# EAGLE design 3bp (EAGLE 9.6.2)
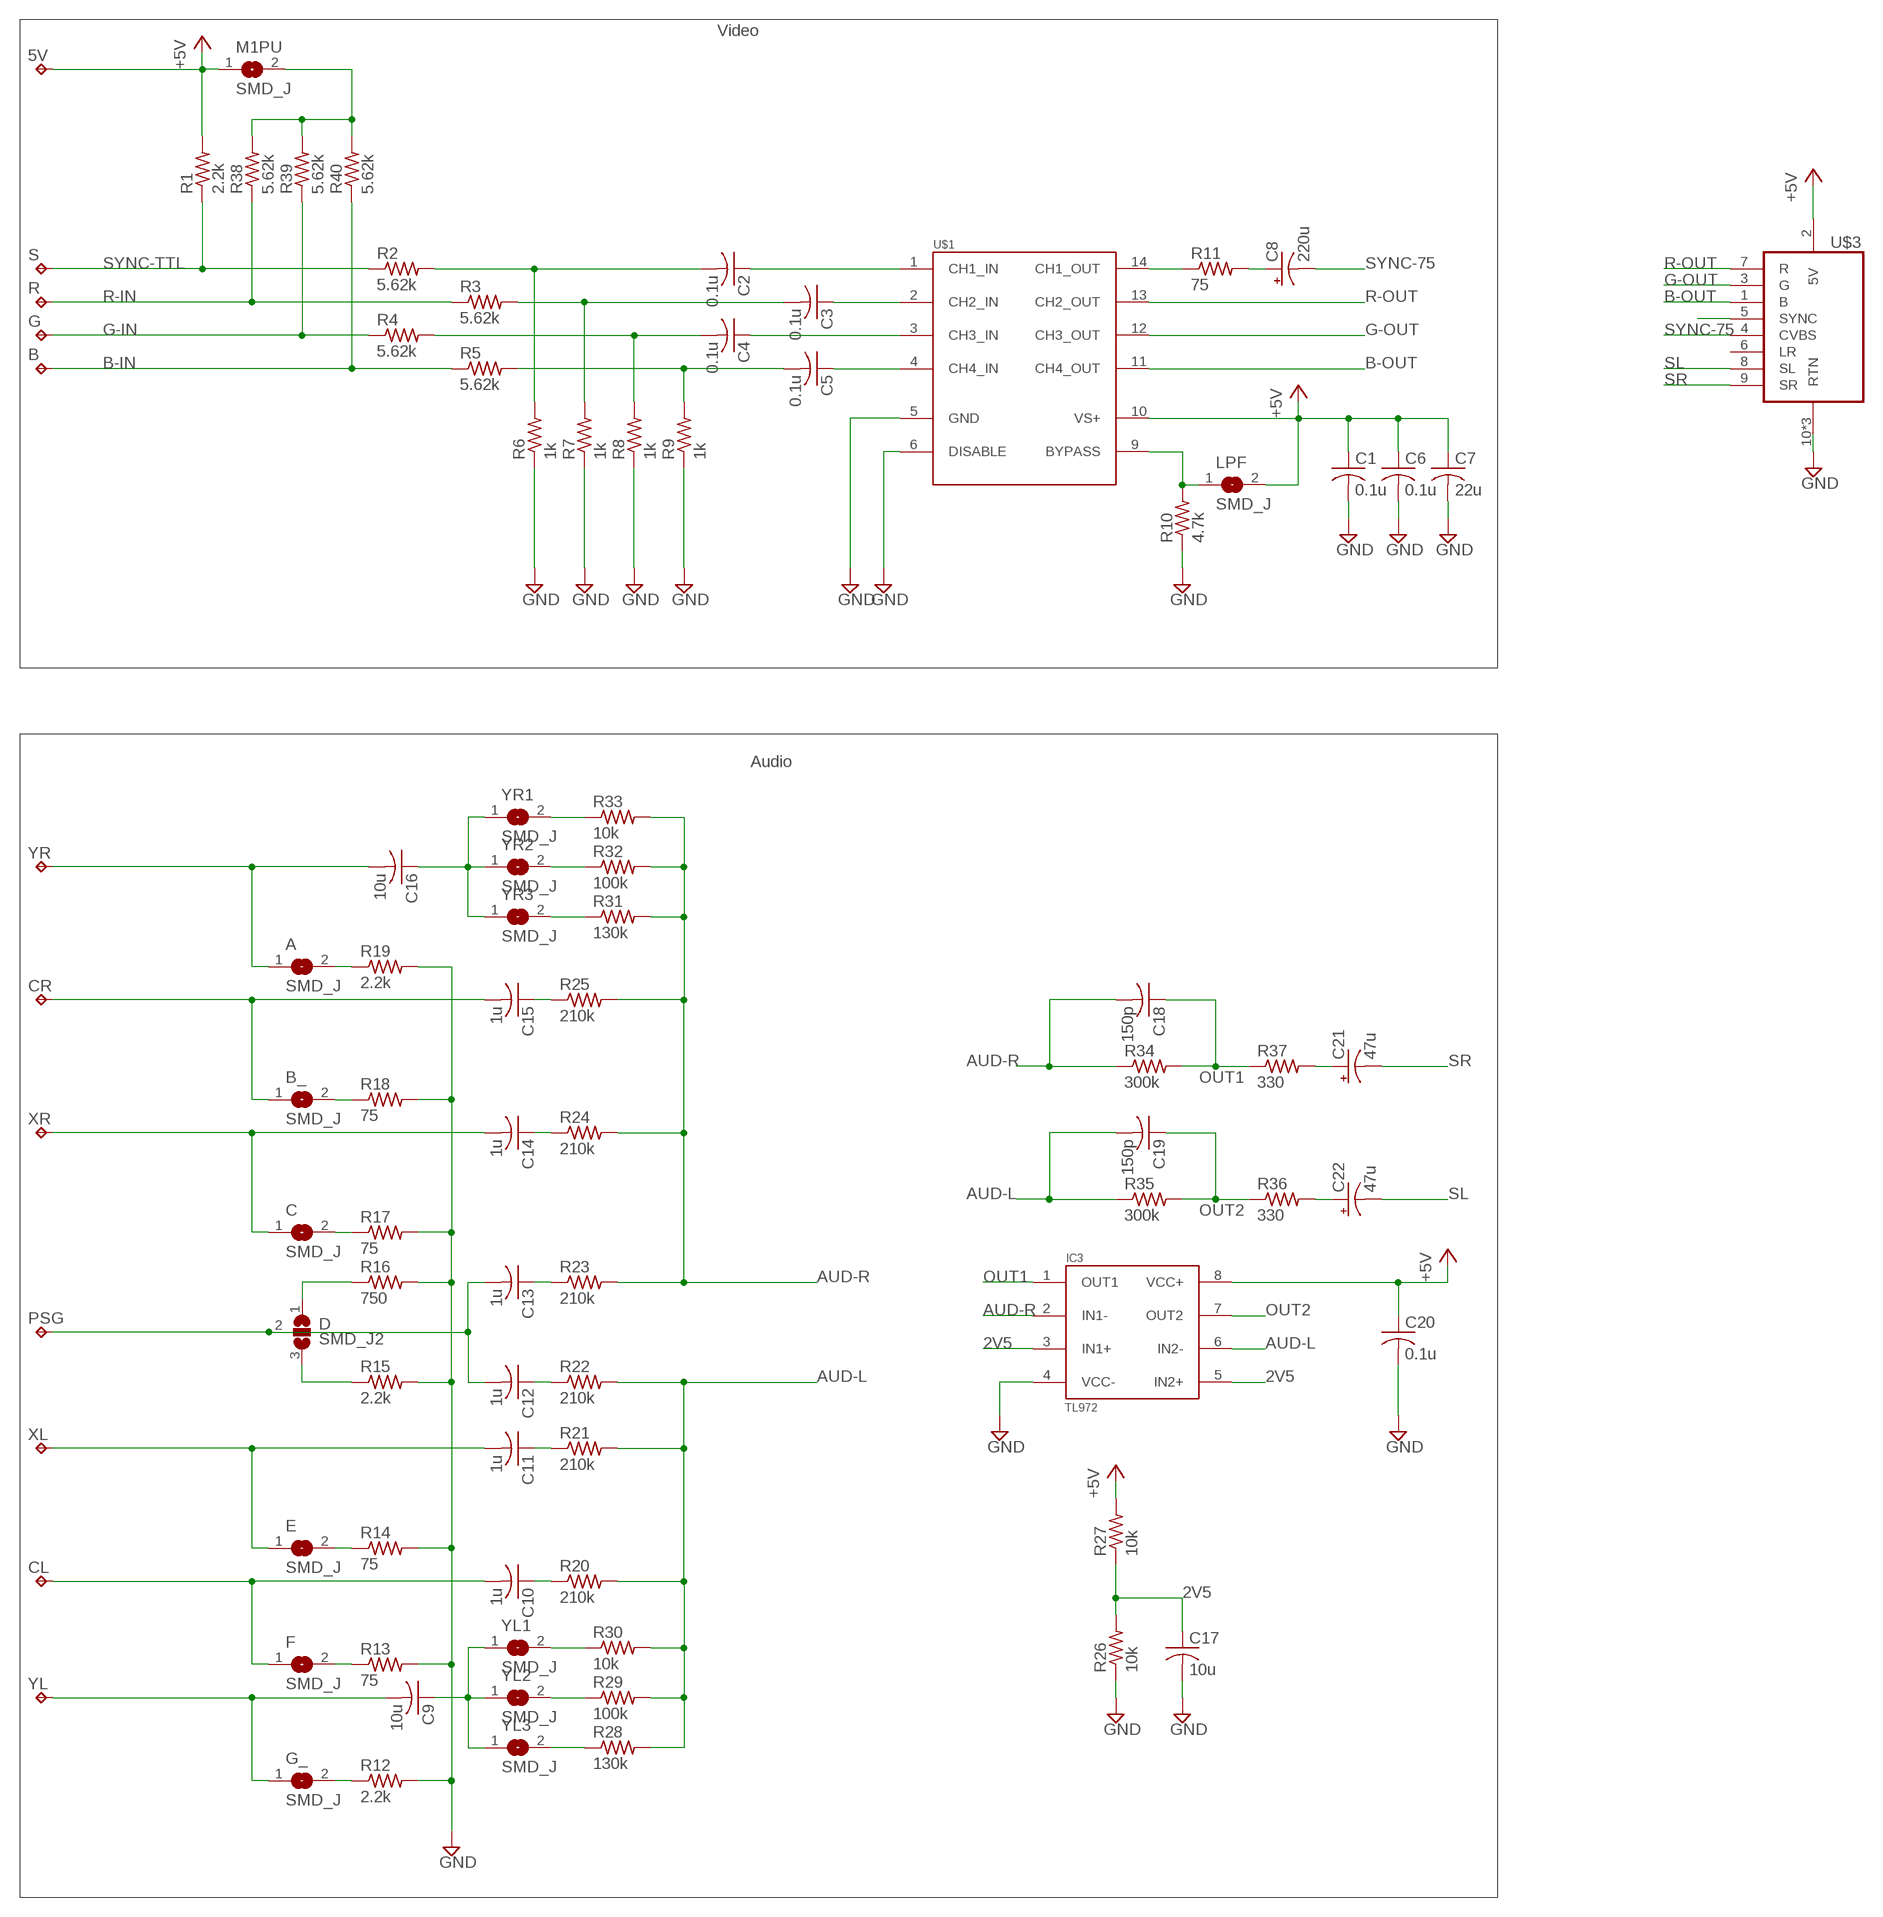
[diagram p0: schematic, sheet 1]

## Parts
5V  PAD_50X80  [TP_50X80]
A  SMD_J  [SJ]
B  PAD_50X80  [TP_50X80]
B_  SMD_J  [SJ]
C  SMD_J  [SJ]
C1  0.1u  C-USC0603  [C0603]
C2  0.1u  C-USC0603  [C0603]
C3  0.1u  C-USC0603  [C0603]
C4  0.1u  C-USC0603  [C0603]
C5  0.1u  C-USC0603  [C0603]
C6  0.1u  C-USC0603  [C0603]
C7  22u  C-USC1206  [C1206]
C8  220u  CPOL-USCT3528  [CT3528]
C9  10u  C-USC0805  [C0805]
C10  1u  C-USC0603  [C0603]
C11  1u  C-USC0603  [C0603]
C12  1u  C-USC0603  [C0603]
C13  1u  C-USC0603  [C0603]
C14  1u  C-USC0603  [C0603]
C15  1u  C-USC0603  [C0603]
C16  10u  C-USC0805  [C0805]
C17  10u  C-USC1206  [C1206]
C18  150p  C-USC0603  [C0603]
C19  150p  C-USC0603  [C0603]
C20  0.1u  C-USC0603  [C0603]
C21  47u  CPOL-USCT3528  [CT3528]
C22  47u  CPOL-USCT3528  [CT3528]
CL  PAD_50X80  [TP_50X80]
CR  PAD_50X80  [TP_50X80]
D  SMD_J2  [SJ_2]
E  SMD_J  [SJ]
F  SMD_J  [SJ]
G  PAD_50X80  [TP_50X80]
G_  SMD_J  [SJ]
IC3  TL972  [SOIC8]
LPF  SMD_J  [SJ]
M1PU  SMD_J  [SJ]
PSG  PAD_50X80  [TP_50X80]
R  PAD_50X80  [TP_50X80]
R1  2.2k  R-US_R0603  [R0603]
R2  5.62k  R-US_R0603  [R0603]
R3  5.62k  R-US_R0603  [R0603]
R4  5.62k  R-US_R0603  [R0603]
R5  5.62k  R-US_R0603  [R0603]
R6  1k  R-US_R0603  [R0603]
R7  1k  R-US_R0603  [R0603]
R8  1k  R-US_R0603  [R0603]
R9  1k  R-US_R0603  [R0603]
R10  4.7k  R-US_R0603  [R0603]
R11  75  R-US_R0603  [R0603]
R12  2.2k  R-US_R0603  [R0603]
R13  75  R-US_R0603  [R0603]
R14  75  R-US_R0603  [R0603]
R15  2.2k  R-US_R0603  [R0603]
R16  750  R-US_R0603  [R0603]
R17  75  R-US_R0603  [R0603]
R18  75  R-US_R0603  [R0603]
R19  2.2k  R-US_R0603  [R0603]
R20  210k  R-US_R0603  [R0603]
R21  210k  R-US_R0603  [R0603]
R22  210k  R-US_R0603  [R0603]
R23  210k  R-US_R0603  [R0603]
R24  210k  R-US_R0603  [R0603]
R25  210k  R-US_R0603  [R0603]
R26  10k  R-US_R0603  [R0603]
R27  10k  R-US_R0603  [R0603]
R28  130k  R-US_R0603  [R0603]
R29  100k  R-US_R0603  [R0603]
R30  10k  R-US_R0603  [R0603]
R31  130k  R-US_R0603  [R0603]
R32  100k  R-US_R0603  [R0603]
R33  10k  R-US_R0603  [R0603]
R34  300k  R-US_R0603  [R0603]
R35  300k  R-US_R0603  [R0603]
R36  330  R-US_R0603  [R0603]
R37  330  R-US_R0603  [R0603]
R38  5.62k  R-US_R0603  [R0603]
R39  5.62k  R-US_R0603  [R0603]
R40  5.62k  R-US_R0603  [R0603]
S  PAD_50X80  [TP_50X80]
U$1  THS7374IPWR  [TSSOP14]
U$3  MD-90SM  [MD90SM]
XL  PAD_50X80  [TP_50X80]
XR  PAD_50X80  [TP_50X80]
YL  PAD_50X80  [TP_50X80]
YL1  SMD_J  [SJ]
YL2  SMD_J  [SJ]
YL3  SMD_J  [SJ]
YR  PAD_50X80  [TP_50X80]
YR1  SMD_J  [SJ]
YR2  SMD_J  [SJ]
YR3  SMD_J  [SJ]

## Nets
2V5: C17.1 IC3.3(IN1+) IC3.5(IN2+) R26.2 R27.1
+5V: 5V.TP C1.1 C6.1 C7.1 C20.1 IC3.8(VCC+) LPF.2 M1PU.1 R1.2 R27.2 U$1.10(VS+) U$3.2(5V)
AUD-L: C19.2 IC3.6(IN2-) R20.2 R21.2 R22.2 R28.2 R29.2 R30.2 R35.1
AUD-R: C18.2 IC3.2(IN1-) R23.2 R24.2 R25.2 R31.2 R32.2 R33.2 R34.1
B-IN: B.TP R5.1 R40.1
B-OUT: U$1.11(CH4_OUT) U$3.1(B)
CL: C10.2 CL.TP F.1
CR: B_.1 C15.2 CR.TP
G-IN: G.TP R4.1 R39.1
G-OUT: U$1.12(CH3_OUT) U$3.3(G)
GND: C1.2 C6.2 C7.2 C17.2 C20.2 IC3.4(VCC-) R6.1 R7.1 R8.1 R9.1 R10.1 R12.2 R13.2 R14.2 R15.2 R16.2 R17.2 R18.2 R19.2 R26.1 U$1.5(GND) U$1.6(DISABLE) U$3.10(RTN) U$3.11(RTN) U$3.12(RTN)
N$1: C2.2 R2.2 R6.2
N$2: C2.1 U$1.1(CH1_IN)
N$3: C3.2 R3.2 R7.2
N$4: C3.1 U$1.2(CH2_IN)
N$5: C4.2 R4.2 R8.2
N$6: C4.1 U$1.3(CH3_IN)
N$7: C5.1 U$1.4(CH4_IN)
N$8: C5.2 R5.2 R9.2
N$9: LPF.1 R10.2 U$1.9(BYPASS)
N$10: M1PU.2 R38.2 R39.2 R40.2
N$11: B_.2 R18.1
N$12: A.2 R19.1
N$13: R11.1 U$1.14(CH1_OUT)
N$14: C8.+ R11.2
N$15: U$3.5(SYNC)
N$16: C16.1 YR1.1 YR2.1 YR3.1
N$17: R33.1 YR1.2
N$18: R32.1 YR2.2
N$19: R31.1 YR3.2
N$20: E.2 R14.1
N$21: C15.1 R25.1
N$22: C.2 R17.1
N$23: C14.1 R24.1
N$25: D.3 R15.1
N$26: D.1 R16.1
N$27: C13.1 R23.1
N$28: C12.1 R22.1
N$29: G_.2 R12.1
N$30: C11.1 R21.1
N$32: F.2 R13.1
N$33: C10.1 R20.1
N$34: C9.1 YL1.1 YL2.1 YL3.1
N$35: R30.1 YL1.2
N$36: R29.1 YL2.2
N$37: R28.1 YL3.2
N$41: C22.+ R36.2
N$42: C21.+ R37.2
OUT1: C18.1 IC3.1(OUT1) R34.2 R37.1
OUT2: C19.1 IC3.7(OUT2) R35.2 R36.1
PSG: C12.2 C13.2 D.2 PSG.TP
R-IN: R3.1 R38.1 R.TP
R-OUT: U$1.13(CH2_OUT) U$3.7(R)
SL: C22.- U$3.8(SL)
SR: C21.- U$3.9(SR)
SYNC-75: C8.- U$3.4(CVBS)
SYNC-TTL: R1.1 R2.1 S.TP
XL: C11.2 E.1 XL.TP
XR: C14.2 C.1 XR.TP
YL: C9.2 G_.1 YL.TP
YR: A.1 C16.2 YR.TP
Unconnected: U$3.6(LR)

## Notes on the sheet
- Video
- Audio

## Library data of the parts
5V B CL CR G PSG R S XL XR YL YR = My_Devices:PAD_50X80
A B_ C E F G_ LPF M1PU YL1-YL3 YR1-YR3 = My_Devices:SMD_J
C1-C7 C9-C20 = My_Devices:C-US: CAPACITOR, American symbol
C8 C21 C22 = rcl:CPOL-US: POLARIZED CAPACITOR, American symbol; SPICEPREFIX: C
D = My_Devices:SMD_J2
IC3 = My_Devices:TL972
R1-R40 = My_Devices:R-US_: RESISTOR, American symbol
U$1 = My_Devices:THS7374
U$3 = My_Devices:MD-90SM

## Board
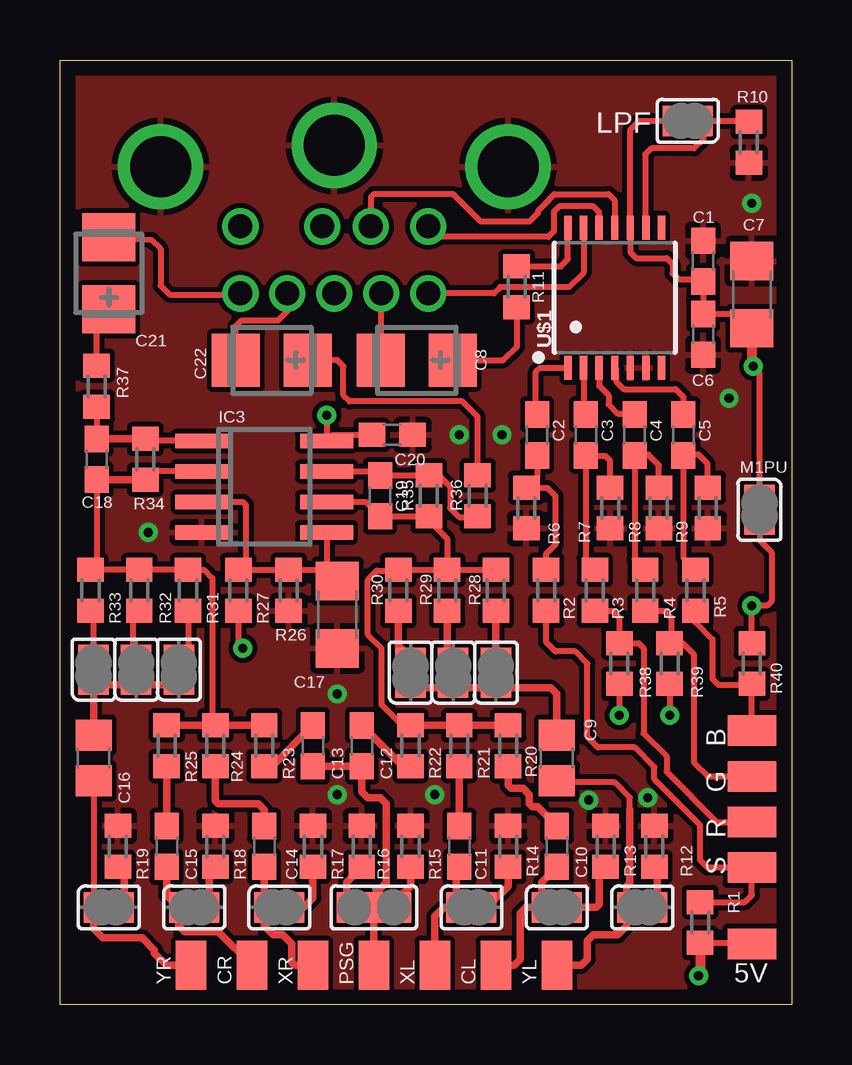
[diagram p1: board, top side]
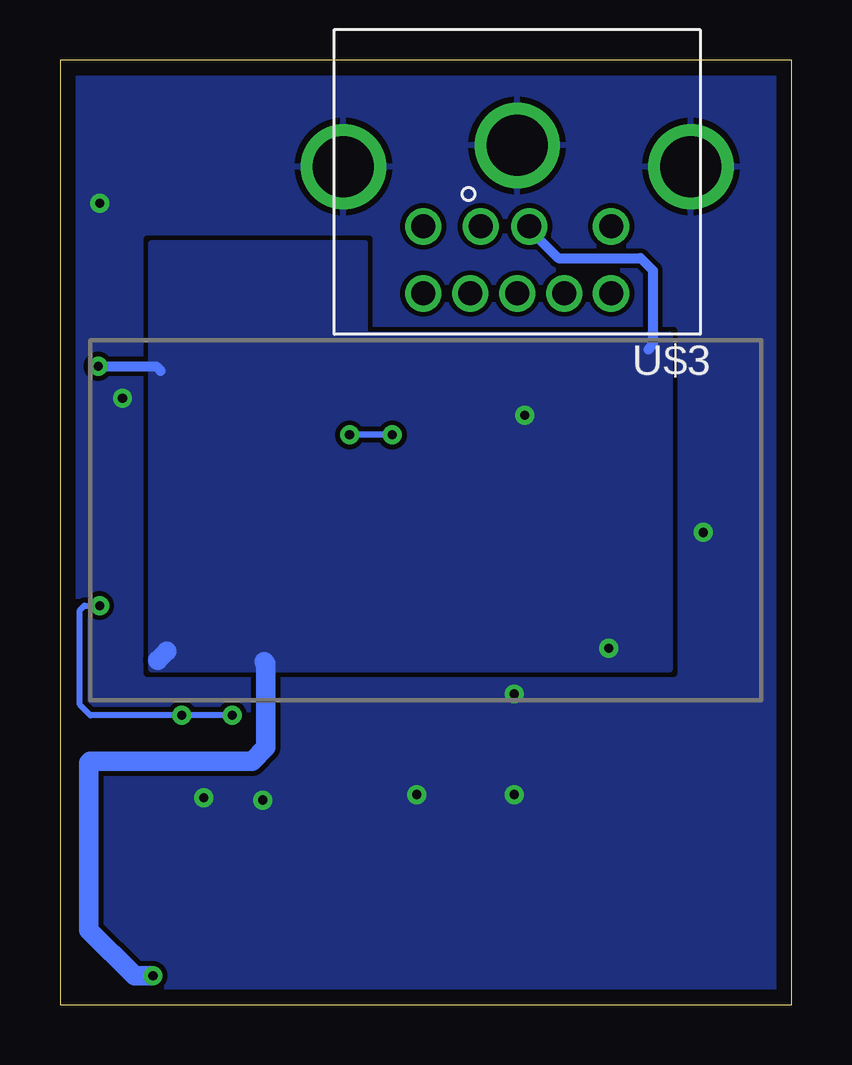
[diagram p2: board, bottom side, seen from below]

Size 30.48 x 39.37 mm. Coordinates in mm from the lower left corner, seen from the top.
Outline: 0,0 0,39.37 30.48,39.37 30.48,0 0,0
Copper layers (1*16): Top 0.035mm / dielectric 1.5mm / Bottom 0.035mm
Design rules "default *": minimum track width 10mil, minimum drill 15mil, track to track 8mil, track to pad 8mil, pad to pad 8mil, via to via 8mil, smd to smd 8mil, copper to edge 25mil, drill to drill 8mil, minimum pad ring 10mil, minimum via ring 8mil, stop-mask expansion 4mil, vias tented up to drill 0mil, thermal gap 10mil

### Footprints (pad centres in the part's own frame; a part is rotated, then mirrored left to right if it is on the bottom)
TP_50X80 = smd 1.27 x 2.032: TP 0,0
SJ = smd 0.813 x 1.27: 1 -0.635,0; 2 0.635,0
C0603 = smd 1.1 x 1: 1 -0.85,0; 2 0.85,0
C1206 = smd 1.6 x 1.8: 1 -1.4,0; 2 1.4,0
CT3528 = smd 2 x 2.2: + -1.5,0; - 1.5,0
C0805 = smd 1.3 x 1.5: 1 -0.95,0; 2 0.95,0
SJ_2 = smd 0.813 x 1.27: 1 -1.143,0; 2 0,0; 3 1.143,0
SOIC8 = smd 0.6 x 2.2: 1 -1.905,-2.6; 2 -0.635,-2.6; 3 0.635,-2.6; 4 1.905,-2.6; 5 1.905,2.6; 6 0.635,2.6; 7 -0.635,2.6; 8 -1.905,2.6
R0603 = smd 1 x 1.1: 1 -0.85,0; 2 0.85,0
TSSOP14 = smd 0.305 x 0.991: 1 -1.95,-2.918; 2 -1.3,-2.918; 3 -0.65,-2.918; 4 0,-2.918; 5 0.65,-2.918; 6 1.3,-2.918; 7 1.95,-2.918; 8 1.95,2.918; 9 1.3,2.918; 10 0.65,2.918; 11 0,2.918; 12 -0.65,2.918; 13 -1.3,2.918; 14 -1.95,2.918
MD90SM = drill 1: 1 1.524,8.204; 2 -0.508,8.204; 3 3.912,8.204; 4 1.956,10.998; 5 0,10.998; 6 -3.912,8.204; 7 3.912,10.998; 8 -1.956,10.998; 9 -3.912,10.998 | drill 2.54: 10 -7.239,5.715; 11 0,4.826; 12 7.239,5.715

### Placement (x,y rotation side)
5V  28.83,2.54 90 top
A  2.03,4.06 0 top
B  28.83,11.43 90 top
B_  5.59,4.06 0 top
C  9.14,4.06 0 top
C1  26.8,30.99 90 top
C2  19.88,23.75 270 top
C3  21.91,23.75 270 top
C4  23.94,23.75 270 top
C5  25.97,23.75 270 top
C6  26.8,27.94 270 top
C7  28.83,29.59 90 top
C8  14.86,26.86 180 top
C9  20.7,10.29 270 top
C10  20.7,6.6 270 top
C11  16.64,6.6 270 top
C12  12.57,10.79 270 top
C13  10.54,10.79 270 top
C14  8.51,6.6 270 top
C15  4.45,6.6 270 top
C16  1.4,10.29 270 top
C17  11.56,16.26 270 top
C18  1.52,22.73 270 top
C19  13.34,21.21 270 top
C20  13.84,23.75 0 top
C21  2.03,30.48 90 top
C22  8.83,26.86 180 top
CL  18.16,1.65 0 top
CR  8,1.65 0 top
D  13.08,4.06 0 top
E  17.14,4.06 0 top
F  20.7,4.06 0 top
G  28.83,9.53 90 top
G_  24.26,4.06 0 top
IC3  8.51,21.59 270 top
LPF  26.16,36.83 180 top
M1PU  29.15,20.64 270 top
PSG  13.08,1.65 0 top
R  28.83,7.62 90 top
R1  26.67,3.43 270 top
R2  20.26,17.27 90 top
R3  22.29,17.27 90 top
R4  24.38,17.27 90 top
R5  26.48,17.27 90 top
R6  19.43,20.7 90 top
R7  22.92,20.7 90 top
R8  24.96,20.7 90 top
R9  26.99,20.7 90 top
R10  28.7,35.94 90 top
R11  19.02,29.92 270 top
R12  24.77,6.6 90 top
R13  22.73,6.6 90 top
R14  18.67,6.6 90 top
R15  14.61,6.6 90 top
R16  12.57,6.6 90 top
R17  10.54,6.6 90 top
R18  6.48,6.6 90 top
R19  2.41,6.6 90 top
R20  18.67,10.79 90 top
R21  16.64,10.79 90 top
R22  14.61,10.79 90 top
R23  8.51,10.79 90 top
R24  6.48,10.79 90 top
R25  4.45,10.79 90 top
R26  9.53,17.27 90 top
R27  7.43,17.27 270 top
R28  18.16,17.27 90 top
R29  16.13,17.27 90 top
R30  14.1,17.27 90 top
R31  5.33,17.27 90 top
R32  3.3,17.27 90 top
R33  1.27,17.27 90 top
R34  3.56,22.73 90 top
R35  15.37,21.21 90 top
R36  17.4,21.21 90 top
R37  1.52,25.78 90 top
R38  23.3,14.22 270 top
R39  25.4,14.22 270 top
R40  28.83,14.22 90 top
S  28.83,5.71 90 top
U$1  23.11,29.46 0 top
U$3  11.43,40.64 180 bottom
XL  15.62,1.65 0 top
XR  10.54,1.65 0 top
YL  20.7,1.65 0 top
YL1  14.61,13.84 90 top
YL2  16.38,13.84 90 top
YL3  18.16,13.84 90 top
YR  5.46,1.65 0 top
YR1  1.4,13.97 90 top
YR2  3.17,13.97 90 top
YR3  4.95,13.97 90 top

### Tracks (layer width: path | path; a pad name or v marks a point on that pad's centre or on a via)
2V5
  Top 0.254: IC3.3 7.62,20.95 7.75,20.83 7.75,18.44 R27.1 R26.2 11.09,18.12 | 11.09,18.12 C17.1 | IC3.5 11.11,18.14 11.09,18.12
+5V  (via drill 0.38)
  Top 0.254: C1.1 C6.1 28.36,28.79 C7.1 | 26.63,29.84 C1.1 | LPF.2 24.13,36.83 23.76,36.46 U$1.10 23.76,31.35 24,31.11 25.27,31.11 25.53,30.86 25.53,30.48 25.78,30.23 26.71,30.23 C1.1 | R1.2 28.79,2.58 5V.TP | v11.11,24.57 IC3.8 11.36,23.75 C20.1 12.74,23.5 | M1PU.1 29.15,26.35 v28.89,26.61 | R27.2 7.43,15.05 v7.62,14.86
  Top 0.406: R1.2 26.67,1.27 v26.61,1.21 | C7.1 28.83,26.67 v28.89,26.61
  Bottom 0.406: U$3.2 10.92,32.32 9.72,31.11 6.29,31.11 5.78,30.61 5.78,27.5 5.97,27.3 | v28.89,26.61 26.48,26.61 26.29,26.42
  Bottom 0.813: v26.61,1.21 27.37,1.21 29.27,3.11 29.27,10.1 29.21,10.16 22.48,10.16 21.91,10.73 21.91,14.22 21.97,14.29 | 26.42,14.35 26.04,14.73
  pour Bottom: 5.08,27.94 5.08,13.97 26.67,13.97 26.67,31.75 17.78,31.75 17.78,27.94
AUD-L
  Top 0.254: IC3.6 12.74,20.95 C19.2 R35.1 15.37,20.19 16.13,19.43 R29.2 | R29.2 R30.2 14.07,18.1 13.21,18.1 12.83,17.72 12.83,15.43 13.4,14.86 13.4,12.51 14.26,11.64 R22.2 | R29.2 R28.2
  Top 0.305: R22.2 R21.2 R20.2
AUD-R
  Top 0.254: IC3.2 3.9,22.23 R34.1 | R24.2 6.35,11.77 6.35,17.78 6.01,18.12 R31.2 R32.2 R33.2 1.52,18.38 C18.2
  Top 0.305: C18.2 R34.1 | R25.2 R24.2 R23.2
B-IN
  Top 0.254: B.TP R40.1 28.79,13.34 27.43,13.34 27.18,13.59 27.18,15.24 26.48,15.94 R5.1
B-OUT
  Top 0.254: U$1.11 23.11,33.53 22.86,33.78 20.6,33.78 20.34,33.53 20.34,33.5 19.91,33.07 19.91,32.99 19.56,32.64 17.53,32.64 16.38,33.78 13.08,33.78 12.95,33.66 U$3.1
CL
  Top 0.305: CL.TP 18.92,1.65 19.18,1.91 19.18,3.81 19.43,4.06 F.1 20.07,5.12 C10.2
CR
  Top 0.305: C15.2 4.45,4.57 B_.1 4.95,3.3 5.21,3.05 6.6,3.05 CR.TP
G-IN
  Top 0.254: R4.1 25.17,16.42 25.46,16.13 25.46,15.14 R39.1 25.95,15.07 26.42,14.61 26.42,10.1 26.99,9.53 G.TP
G-OUT
  Top 0.254: U$1.12 22.46,33.03 22.23,33.27 20.8,33.27 20.57,33.05 20.57,32.23 20.34,32 15.77,32 U$3.3
GND  (via drill 0.38)
  Bottom 0.254: v16.64,23.75 v18.41,23.75
  other vias: 28.83,33.4 15.62,8.76 11.56,8.76 3.68,19.68 22.03,8.53 27.88,25.27 11.56,12.95 24.49,8.64
  pour Top: -1.27,39.37 31.75,39.37 31.75,-1.27 -1.27,-1.27
  pour Bottom (rank 2): -2.54,40.64 33.02,40.64 33.02,-2.54 -2.54,-2.54
N$1
  Top 0.254: R2.2 20.26,18.8 20.64,19.18 20.64,21.21 20.32,21.53 19.46,21.53 R6.2 19.88,22 C2.2
N$2
  Top 0.254: C2.1 19.83,24.64 19.83,26.37 20,26.54 U$1.1
N$3
  Top 0.254: R7.2 22.92,22.67 22.73,22.86 21.95,22.86 C3.2 21.91,18.5 R3.2
N$4
  Top 0.254: U$1.2 21.81,24.69 C3.1
N$5
  Top 0.254: R4.2 23.94,18.57 C4.2 23.96,22.92 24.51,22.92 24.96,22.48 R8.2
N$6
  Top 0.254: U$1.3 22.46,25.8 22.86,25.4 22.86,25.02 23.24,24.64 23.9,24.64 C4.1
N$7
  Top 0.254: C5.1 25.97,25.34 25.65,25.65 23.5,25.65 23.18,25.97 23.18,26.48 U$1.4
N$8
  Top 0.254: R5.2 25.97,18.63 C5.2 26,22.92 26.61,22.92 26.99,22.54 R9.2
N$9
  Top 0.254: R10.2 28.66,36.83 LPF.1 26.8,36.07 26.42,35.69 24.64,35.69 24.38,35.43 24.38,32.41 U$1.9
N$10  (via drill 0.38)
  Top 0.254: R39.2 v25.4,12.06 | R38.2 v23.3,12.06 | R40.2 v28.83,16.64 29.46,16.64 29.65,16.83 29.65,18.86 29.15,19.37 M1PU.2
  Bottom 0.254: v23.3,12.06 v25.4,12.06 29.21,12.06 29.65,12.51 29.65,16.45 29.46,16.64 v28.83,16.64
N$11
  Top 0.305: B_.2 6.22,5.5 R18.1
N$12
  Top 0.305: A.2 2.67,5.5 R19.1
N$13
  Top 0.254: R11.1 20.86,30.77 21.16,31.07 U$1.14
N$14
  Top 0.254: C8.+ 18.48,26.86 19.05,27.43 19.05,29.05 R11.2
N$16
  Top 0.305: C16.1 YR1.1 YR2.1 YR3.1
N$17
  Top 0.254: YR1.2 1.4,16.3 R33.1
N$18
  Top 0.254: 3.05,14.73 3.05,16.17 R32.1
  Top 0.305: 3.05,14.73 YR2.2
N$19
  Top 0.254: R31.1 5.33,14.99 YR3.2
N$20
  Top 0.305: R14.1 18.67,4.95 E.2
N$21
  Top 0.305: C15.1 R25.1
N$22
  Top 0.305: C.2 10.16,4.06 10.54,4.45 R17.1
N$23
  Top 0.305: C14.1 8.51,8.13 8.26,8.38 6.6,8.38 6.48,8.51 R24.1
N$25
  Top 0.305: D.3 14.22,4.57 14.61,4.95 R15.1
N$26
  Top 0.305: D.1 11.94,5.12 R16.1
N$27
  Top 0.305: R23.1 8.84,9.95 C13.1
N$28
  Top 0.305: R22.1 14.27,9.95 C12.1
N$29
  Top 0.305: G_.2 24.89,5.63 R12.1
N$30
  Top 0.305: C11.1 R21.1
N$32
  Top 0.305: F.2 22.35,4.06 22.48,4.19 22.48,5.5 R13.1
N$33
  Top 0.305: R20.1 18.67,9.14 18.8,9.02 19.3,9.02 19.56,8.76 19.56,8.38 19.68,8.26 19.9,8.26 C10.1
N$34
  Top 0.305: YL1.1 YL2.1 YL3.1 20.45,13.21 20.7,12.95 C9.1
N$35
  Top 0.305: R30.1 14.1,14.99 YL1.2
N$36
  Top 0.305: R29.1 16.13,14.73 YL2.2
N$37
  Top 0.305: R28.1 YL3.2
N$41
  Top 0.254: R36.2 17.4,24.51 16.76,25.15 12.06,25.15 11.81,25.4 11.81,26.61 11.56,26.86 C22.+
N$42
  Top 0.254: R37.2 1.52,28.57 C21.+
OUT1
  Top 0.254: R37.1 C18.1 | IC3.1 3.64,23.5 R34.2
  Top 0.305: C18.1 R34.2
OUT2
  Top 0.254: IC3.7 13.17,22.23 C19.1 R35.2 15.79,22.06 16.26,21.59 16.26,20.7 16.64,20.32 17.36,20.32 R36.1
PSG
  Top 0.305: PSG.TP D.2 13.08,4.57 13.59,5.08 13.59,8.38 13.34,8.64 12.83,8.64 12.57,8.89 C12.2 C13.2
R-IN
  Top 0.254: R3.1 23.01,16.42 23.3,16.13 R38.1 24.11,15.07 24.32,14.86 24.32,11.3 25.27,10.35 25.27,9.72 27.37,7.62 R.TP
R-OUT
  Top 0.254: U$1.13 21.81,30.51 21.2,29.9 18.34,29.9 18.08,29.64 U$3.7
SL
  Top 0.254: U$3.8 9.47,28.91 9.08,28.51 7.56,28.51 7.3,28.26 7.3,26.88 C22.-
SR
  Top 0.254: C21.- 3.81,31.88 4.19,31.5 4.19,29.97 4.57,29.59 7.47,29.59 U$3.9
SYNC-75
  Top 0.254: U$3.4 13.36,29.61 C8.-
SYNC-TTL
  Top 0.254: R1.1 28.54,4.28 28.83,4.57 S.TP 26.99,5.71 26.67,6.03 26.67,7.49 24.77,9.4 24.77,9.91 23.94,10.73 22.42,10.73 21.97,11.18 21.97,14.22 21.46,14.73 20.64,14.73 20.26,15.11 R2.1
XL
  Top 0.305: XL.TP 15.62,3.68 16,4.06 E.1 16.51,5.63 C11.2
XR
  Top 0.305: C14.2 C.1 8.51,3.3 8.89,2.92 9.27,2.92 9.65,2.54 9.65,1.78 9.78,1.65 XR.TP
YL
  Top 0.254: 23.75,8.13 23.75,8.64 23.11,9.27 20.77,9.27 C9.2
  Top 0.305: YL.TP 21.72,1.65 21.97,1.91 21.97,2.67 22.23,2.92 23.24,2.92 23.62,3.3 G_.1 23.62,4.95 23.75,5.08 23.75,8.13
YR
  Top 0.254: C16.2 A.1
  Top 0.305: A.1 1.4,3.17 1.78,2.79 3.43,2.79 3.94,2.29 3.94,2.16 4.45,1.65 YR.TP

### Text on the board
tDocu: 3BP / v2a | a | b | c | d | e | f | g
bDocu: 5v | B | G | SR | SL | S75 | R | M1va0-6.5= 1, M1PU / M1va7 = 2, c, d-right, e, M1PU / / / ------------------------------- / M2va0-1.8= 2, c, d-right, e / M2Va3= 2 / M2va2-2.3= 1, d-left / M2va4= 3, d-right / ------------------------------- / M3va1/2= 3, b, c, d-right, e, f | TRIPLE BYPASS V2a / / Edited by @zaxour / Original Design by 天峰/db electronics / Licensed under CERN OHL v1.2